# EasyEDA Pro project 无线充电发射板.eprj, schematic Schematic1
Create Date: 2023-07-04; Page Name: P1; Project Name: 高仿逐飞发射 (MOS管改）2; Schematic Name: Schematic1; Update Date: 2023-07-04; Company: 嘉立创EDA; Page Size: A4; Version: V1.0
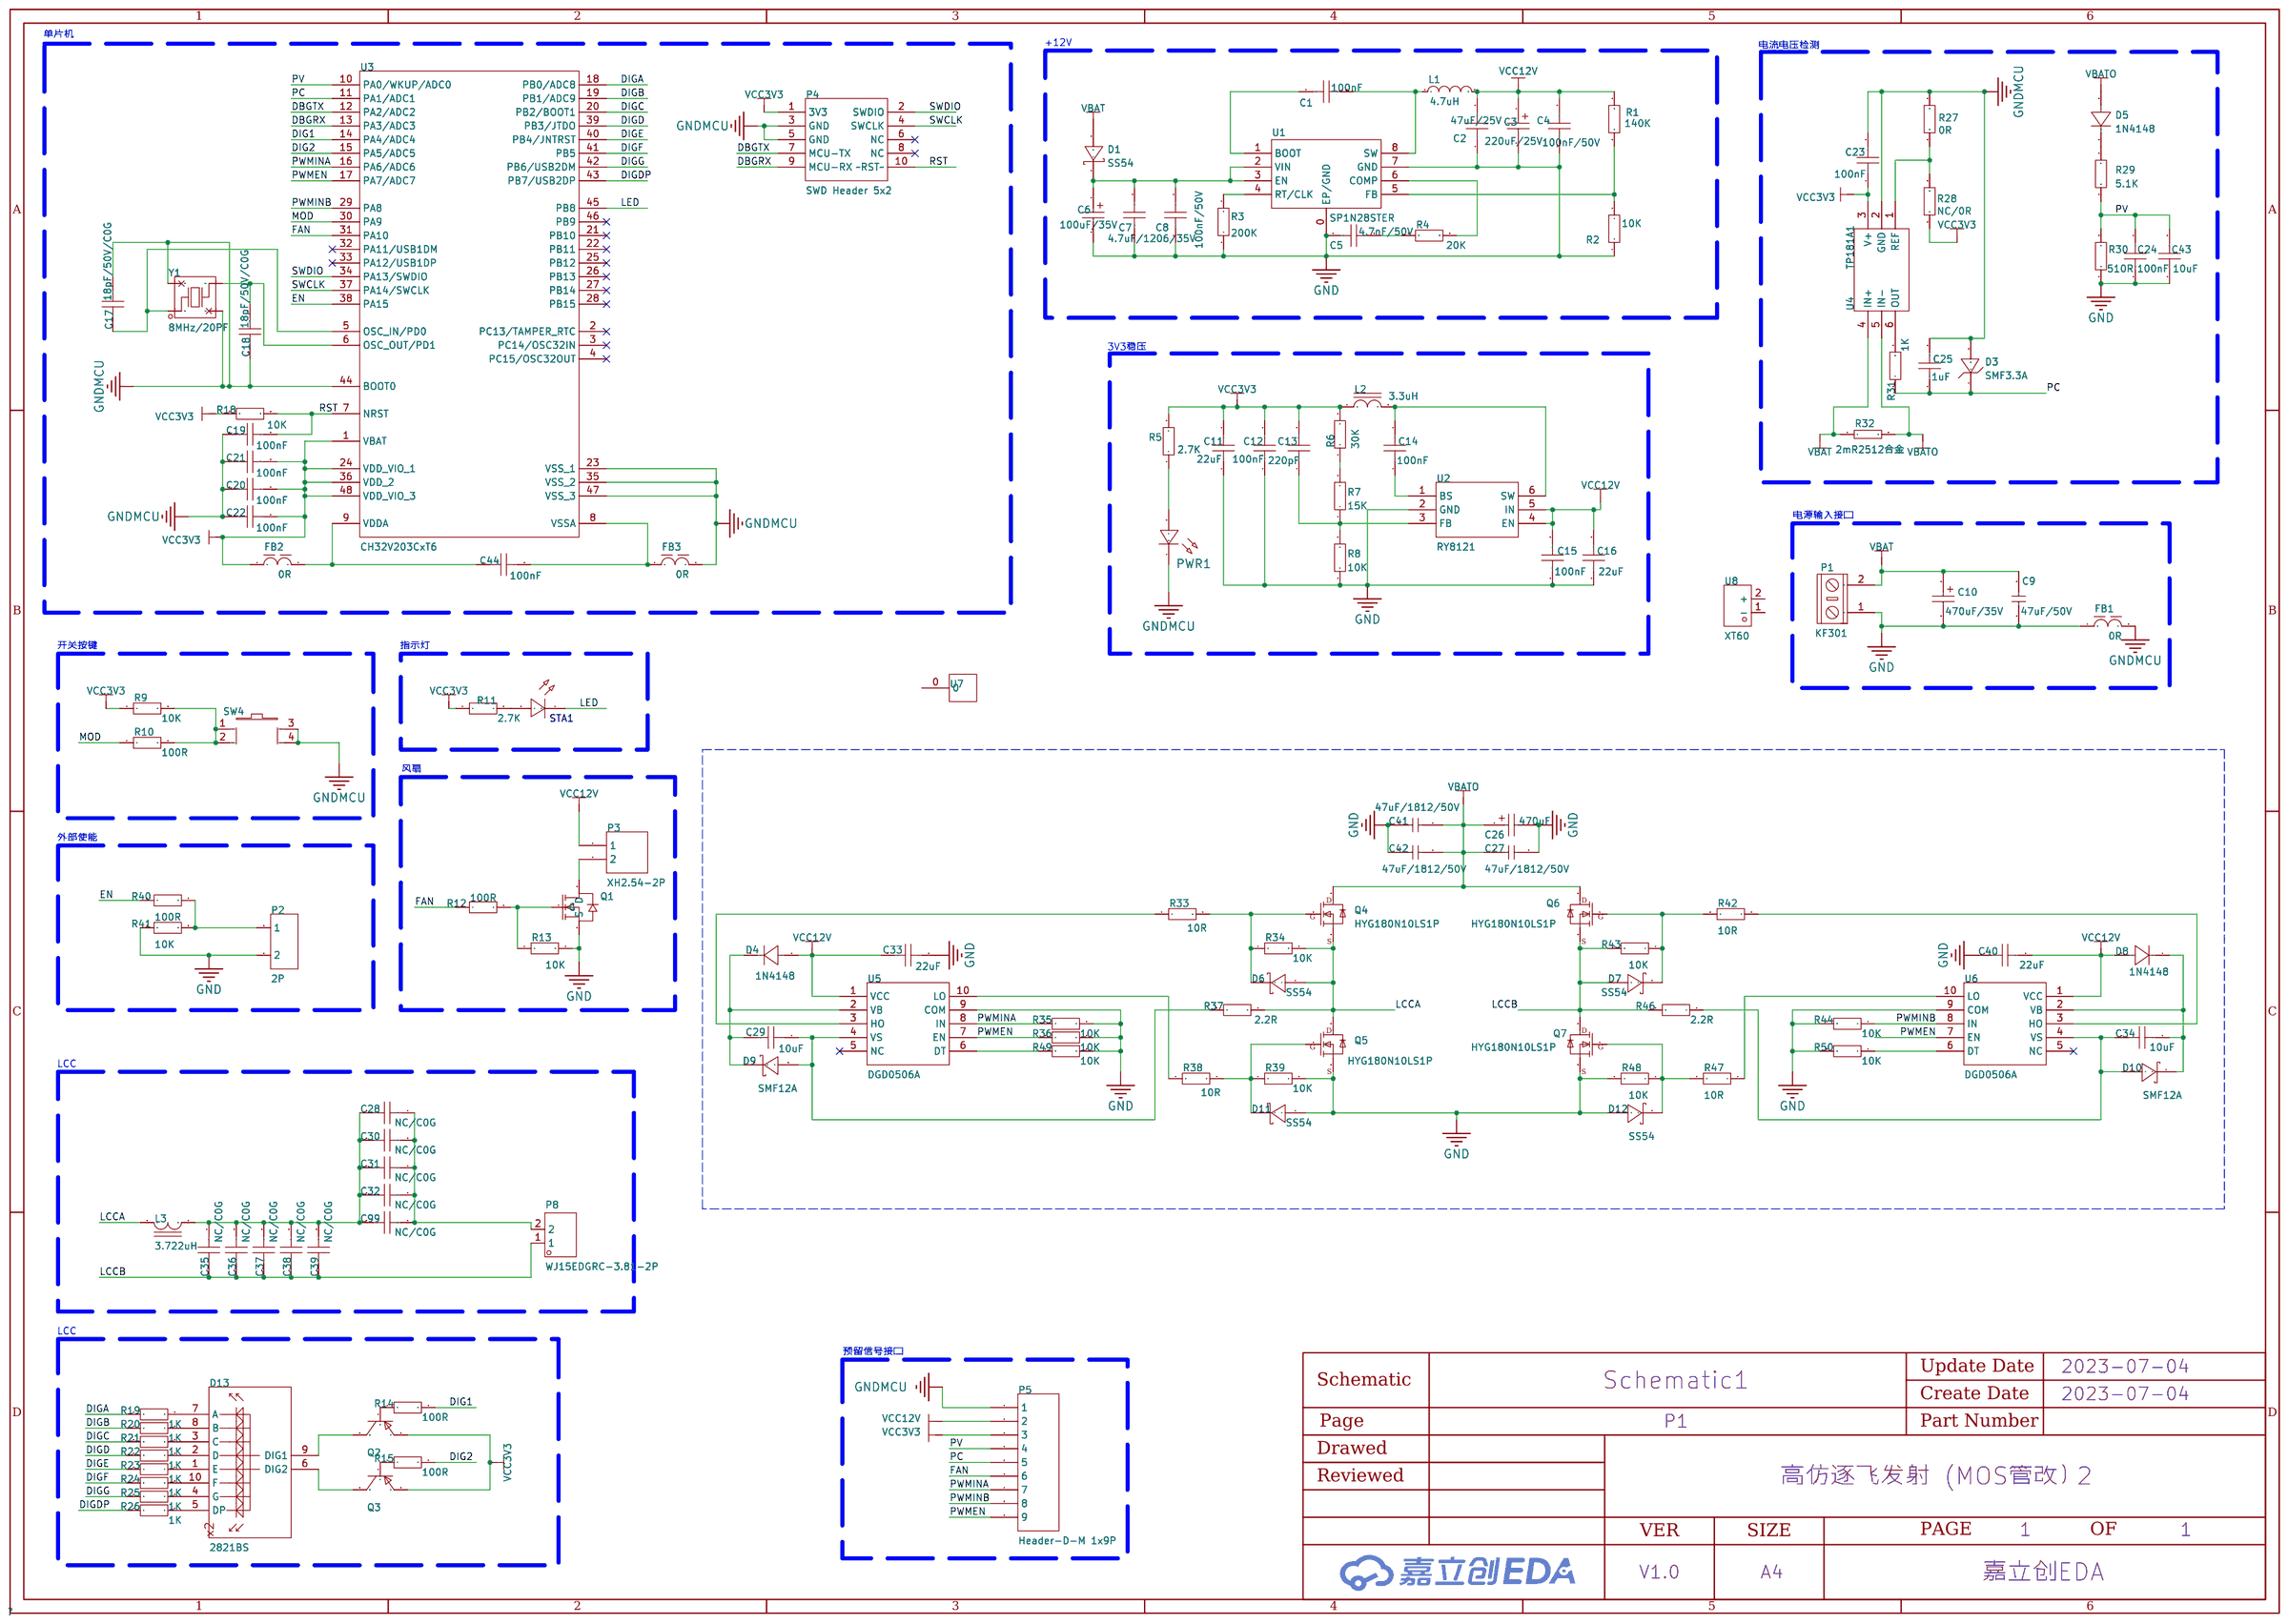
[diagram p0: schematic sheet]

## Parts
C1  100nF  [R0603]
C2  47uF/25V  [C1206]
C3  220uF  [Cap-S-D 2.5-6.3X8]
C4  100nF/50V  [R0603]
C5  4.7nF/50V  [R0603]
C6  100uF  [Cap-S-D 2.5-6.3X8]
C7  4.7uF/1206/35V  [C1206]
C8  100nF/50V  [R0603]
C9  47uF  [CAPC4532[1812]S]
C10  470uF  [Cap-S-D 3.5-8x14]
C11  22uF  [C0805]
C12  100nF  [R0603]
C13  220pF  [R0603]
C14  100nF  [R0603]
C15  100nF  [R0603]
C16  22uF  [C0805]
C17  18pF/50V/C0G  [R0603]
C18  18pF/50V/C0G  [R0603]
C19  100nF  [R0603]
C20  100nF  [R0603]
C21  100nF  [R0603]
C22  100nF  [R0603]
C23  100nF  [R0603]
C24  100nF  [R0603]
C25  1uF  [R0603]
C26  470uF  [Cap-S-D 3.5-8x14]
C27  47uF  [CAPC4532[1812]S]
C28  NC/C0G  [C1206]
C29  10uF  [C0805]
C30  NC/C0G  [C1206]
C31  NC/C0G  [C1206]
C32  NC/C0G  [C1206]
C33  22uF  [C0805]
C34  10uF  [C0805]
C35  NC/C0G  [C1206]
C36  NC/C0G  [C1206]
C37  NC/C0G  [C1206]
C38  NC/C0G  [C1206]
C39  NC/C0G  [C1206]
C40  22uF  [C0805]
C41  47uF  [CAPC4532[1812]S]
C42  47uF  [CAPC4532[1812]S]
C43  10uF  [C0805]
C44  100nF  [R0603]
C99  NC/C0G  [C1206]
D1  SS54  [SMA_L4.4-W2.8-LS5.4-R-RD]
D3  SMF3.3A  [SOD-123_L2.8-W1.8-LS3.7-RD]
D4  1N4148  [SOD-123_L2.7-W1.6-LS3.7-RD]
D5  1N4148  [SOD-123_L2.7-W1.6-LS3.7-RD]
D6  SS54  [SMA_L4.4-W2.8-LS5.4-R-RD]
D7  SS54  [SMA_L4.4-W2.8-LS5.4-R-RD]
D8  1N4148  [SOD-123_L2.7-W1.6-LS3.7-RD]
D9  SMF12A  [SOD-123F_L2.8-W1.8-LS3.7-RD]
D10  SMF12A  [SOD-123F_L2.8-W1.8-LS3.7-RD]
D11  SS54  [SMA_L4.4-W2.8-LS5.4-R-RD]
D12  SS54  [SMA_L4.4-W2.8-LS5.4-R-RD]
D13  2821BS  [2821AS/BS]
FB1  0R  [INDC1608[0603]S]
FB2  0R  [INDC1608[0603]S]
FB3  0R  [INDC1608[0603]S]
L1  4.7uH  [IND-SMD_L7.3-W6.6]
L2  3.3uH  [0402 TPC 4*4*2]
L3  3.722uH  [T94/106-LAY]
P1  KF301  [KF/WJ/DG 301-2p-5.0mm]
P2  2P  [HDR-TH_2P-P2.54-V-M-1]
P3  XH2.54-2P  [XH2.54-2P-DV]
P4  SWD  [HDR2X5-M]
P5  Header-D-M1x9P  [HDR1X9-M]
P8  WJ15EDGRC-3.81-2P  [CONN-TH_2P-P3.81_WJ15EDGRC-3.81-2P]
PWR1  -  [LED_0603]
Q1  -  [SOT-23-3_L2.9-W1.3-P1.90-LS2.4-BR]
Q2  -  [S8550P_SOT]
Q3  -  [S8550P_SOT]
Q4  HYG180N10LS1P  [TO-220-LAY]
Q5  HYG180N10LS1P  [TO-220-LAY]
Q6  HYG180N10LS1P  [TO-220-LAY]
Q7  HYG180N10LS1P  [TO-220-LAY]
R1  140K  [R0603]
R2  10K  [R0603]
R3  200K  [R0603]
R4  20K  [R0603]
R5  2.7K  [R0603]
R6  30K  [R0603]
R7  15K  [R0603]
R8  10K  [R0603]
R9  10K  [R0603]
R10  100R  [R0603]
R11  2.7K  [R0603]
R12  100R  [R0603]
R13  10K  [R0603]
R14  100R  [R0603]
R15  100R  [R0603]
R18  10K  [R0603]
R19  1K  [R0603]
R20  1K  [R0603]
R21  1K  [R0603]
R22  1K  [R0603]
R23  1K  [R0603]
R24  1K  [R0603]
R25  1K  [R0603]
R26  1K  [R0603]
R27  0R  [R0603]
R28  NC/0R  [R0603]
R29  5.1K  [R0603]
R30  510R  [R0603]
R31  1K  [R0603]
R32  2mR  [RESC6332[2512]S]
R33  10R  [R0805_NEW]
R34  10K  [R0805_NEW]
R35  10K  [R0603]
R36  10K  [R0603]
R37  2.2R  [R0805_NEW]
R38  10R  [R0805_NEW]
R39  10K  [R0805_NEW]
R40  100R  [R0603]
R41  10K  [R0603]
R42  10R  [R0805_NEW]
R43  10K  [R0805_NEW]
R44  10K  [R0603]
R46  2.2R  [R0805_NEW]
R47  10R  [R0805_NEW]
R48  10K  [R0805_NEW]
R49  10K  [R0603]
R50  10K  [R0603]
STA1  -  [LED_0603]
SW4  PTS810SJG250SMTRLFS  [SW-SMD_4P_PTS810SJM250SMTRLFS]
U1  SP1N28STER  [SP1N28STER]
U2  RY8121  [SOT-23-6]
U3  CH32V203CxT6  [LQFP48_L]
U4  TP181A1  [SOT-363]
U5  DGD0506A  [MSOP-10]
U6  DGD0506A  [MSOP-10]
U7  -  [Cooler-5.5]
U8  XT60  [CONN-TH_XT60]
Y1  8MHz/20PF  [X3225-4]

## Library data of the parts
C1 C4 C5 C8 C12-C15 C17-C25 C44 = CAP_0603: Supplier Footprint: 0603
C2 C7 C28 C30-C32 C35-C39 C99 = CAP_1206: Supplier Footprint: 1206
C3 = S-D 220uF 25V 6.3x8: Revision: V1.0; Type: 聚合物固态; Voltage: 25V
C6 = S-D 100uF 35V 6.3x8: Revision: V1.0; Type: 聚合物固态; Voltage: 35V
C9 C27 C41 C42 = 47uF 1812 50V X5R: Revision: V1.0; Voltage: 50V; Type: X5R; Origin Footprint 2: CAPC4532[1812]
C10 C26 = S-D 470uF 35V 8x14: Revision: V1.0; Type: 聚合物固态; Voltage: 35V
C11 C16 C29 C33 C34 C40 C43 = CAP_0805: Supplier Footprint: 0805
D1 D6 D7 D11 D12 = SS54_C22452: 直流反向耐压(Vr):40V;平均整流电流(Io):5A;正向压降(Vf):550mV@5A;; LCSC Part Name: 40V5A550mV@5A; Supplier Part: C22452; Manufacturer: MDD; Supplier Footprint: SMA(DO-214AC); JLCPCB Part Class: 基础库; Datasheet: https://atta.szlcsc.com/upload/public/pdf/source/20190306/C22452_DC5E4F74C3B638F6D8E4C7650D5BF30E.pdf; Supplier: LCSC; Reverse Voltage (Vr): 40V; Average Rectified Current (Io): 5A; Forward Voltage (Vf@If): 550mV@5A
D3 = SMF3.3A_C283866: 极性:单向;反向截止电压(Vrwm):3.3V;击穿电压:5.2V;反向漏电流(Ir):600uA;峰值脉冲电流(Ipp)@10/1000μs:25A;最大钳位电压:8V;; LCSC Part Name: 单向Vrwm:3.3V; Supplier Part: C283866; Manufacturer: DOWO(东沃); Supplier Footprint: SOD-123; JLCPCB Part Class: ExtendedPart; Datasheet: https://atta.szlcsc.com/upload/public/pdf/source/20180913/C283866_6B3FC7DB82D40F63EC323F6A8CE1774A.pdf; Supplier: LCSC; Polarity: 单向; Reverse Stand-Off Voltage (Vrwm): 3.3V; Breakdown Voltage: 5.2V; Reverse Leakage Current (Ir): 600uA; Peak Pulse Current (Ipp)@10/1000μs: 25A; Maximum Clamping Voltage: 8V
D4 D5 D8 = 1N4148W_C908248: 二极管配置:独立式;功率:400mW;直流反向耐压(Vr):75V;平均整流电流(Io):150mA;正向压降(Vf):1.25V@150mA;反向电流(Ir):2.5μA@75V;反向恢复时间(trr):8ns;工作温度:-55℃~+150℃@(Tj);; LCSC Part Name: 75V150mA8ns; Supplier Part: C908248; Manufacturer: FUXINSEMI(富芯森美); Supplier Footprint: SOD-123; JLCPCB Part Class: ExtendedPart; Datasheet: https://atta.szlcsc.com/upload/public/pdf/source/20201027/C908248_1CA42330540990D53F511325C125C4BD.pdf; Supplier: LCSC; Diode Configuration: 独立式; Power Dissipation: 400mW; Reverse Voltage (Vr): 75V; Average Rectified Current (Io): 150mA; Forward Voltage (Vf@If): 1.25V@150mA; Reverse Leakage Current: 2.5μA@75V; Reverse Recovery Time (trr): 8ns; Operating Temperature: -55℃~+150℃@(Tj)
D9 D10 = SMF12A_C207255: 极性:单向;反向截止电压(Vrwm):12V;击穿电压:13.3V;峰值脉冲电流(Ipp)@10/1000μs:-;最大钳位电压:19.9V;峰值脉冲功率(Ppp)@10/1000μs:200W;; LCSC Part Name: 单向Vrwm:12V200W; Supplier Part: C207255; Manufacturer: Littelfuse(美国力特); Supplier Footprint: SOD-123F; JLCPCB Part Class: ExtendedPart; Datasheet: https://atta.szlcsc.com/upload/public/pdf/source/20180517/C207255_4FB9557FD9A9DAB230014B48638D9A3D.pdf; Supplier: LCSC; Polarity: 单向; Reverse Stand-Off Voltage (Vrwm): 12V; Breakdown Voltage: 13.3V; Maximum Clamping Voltage: 19.9V; Peak Pulse Power Dissipation (Ppp)@10/1000μs: 200W
D13 = 2821BS
FB1-FB3 = FB-Chip: Published: 2020-12-18; Revision: V1.0; DCR: .1m; Frequency: @100MHz; Imax: 500mA; Origin Footprint 2: INDC2012[0805]S; Origin Footprint 3: INDC3216[1206]S; Origin Footprint 4: INDC4509[1806]S; Origin Footprint 5: INDC1005[0402]; Origin Footprint 6: INDC1608[0603]; Origin Footprint 7: INDC2012[0805]; Origin Footprint 8: INDC3216[1206]; Origin Footprint 9: INDC3225[1210]; Origin Footprint 10: INDC3216[1206]; Origin Footprint 11: INDC1005[0402]S
L1 = MCS0630-4R7MPY1: 电感值:4.7uH;精度:±20%;额定电流:5.5A;饱和电流(Isat):7A;直流电阻(DCR):37mΩ;; LCSC Part Name: 4.7uH±20%5.5A37mΩ; Supplier Part: C2937097; Manufacturer: PSA(信昌电陶); Supplier Footprint: 0630; JLCPCB Part Class: 扩展库; Datasheet: https://atta.szlcsc.com/upload/public/pdf/source/20220121/EA6E6E6F70ED7BAE67EC293805EAAACB.pdf; Supplier: LCSC; Tolerance: ±20%; Rated Current: 5.5A; Saturation Current (Isat): 7A; DC Resistance (DCR): 37mΩ
L2 = Ind-Power_1: Published: 8-Jun-2000; Revision: July-2002:Re-releasedforDXPPlatform.; Publisher: AltiumLimited; DCR: .5m; Price(RMB): 0.000; Imax: 2.5A; Origin Footprint 2: CD31; Origin Footprint 3: CD32; Origin Footprint 4: CD42; Origin Footprint 5: CD43; Origin Footprint 6: CD52; Origin Footprint 7: CD53; Origin Footprint 8: CD54; Origin Footprint 9: CD73; Origin Footprint 10: CD75; Origin Footprint 11: CD104; Origin Footprint 12: CD105; Origin Footprint 13: CD106; Origin Footprint 14: 127Shielded12.5*12.5*7; Origin Footprint 15: 0630TPC7*7*3; Origin Footprint 16: 1050TPC10*10*5; Origin Footprint 17: 1265TPC12*12*6.5; Origin Footprint 18: CD104R; Origin Footprint 19: SLO2520; Origin Footprint 20: 1365TPC13*13*6.5; Origin Footprint 21: INDUCTOR; Origin Footprint 22: INDUCTOR-H
L3 = Ind-Power_2: Published: 8-Jun-2000; Revision: July-2002:Re-releasedforDXPPlatform.; Publisher: AltiumLimited; Imax: 50mA; DCR: .5m; Price(RMB): 0.000; Origin Footprint 2: CD31; Origin Footprint 3: CD32; Origin Footprint 4: CD42; Origin Footprint 5: CD43; Origin Footprint 6: CD52; Origin Footprint 7: CD53; Origin Footprint 8: CD54; Origin Footprint 9: CD73; Origin Footprint 10: CD75; Origin Footprint 11: CD104; Origin Footprint 12: CD105; Origin Footprint 13: CD106; Origin Footprint 14: 127Shielded12.5*12.5*7; Origin Footprint 15: 0630TPC7*7*3; Origin Footprint 16: 1050TPC10*10*5; Origin Footprint 17: 1265TPC12*12*6.5; Origin Footprint 18: CD104R; Origin Footprint 19: SLO2520; Origin Footprint 20: 1365TPC13*13*6.5; Origin Footprint 21: T80125
P1 = KF/WJ/DG 30x
P2 = 826629-2: 排数:单排;总PIN位数:2;间距:2.54mm;插针结构:1x2P;行距:-;安装类型:直插;圆针/方针:-;额定电流:-;额定电压:-;配合针长度:-;塑高:2.8mm;触头材质:黄铜;触头镀层:-;颜色:绿色;; LCSC Part Name: 2.54mm1x2P直插; Supplier Part: C86471; Manufacturer: TEConnectivity(美国泰科); Supplier Footprint: 插件,P=2.54mm; JLCPCB Part Class: ExtendedPart; Datasheet: https://atta.szlcsc.com/upload/public/pdf/source/20161105/1478330325829.pdf; Supplier: LCSC; Number of Rows: 单排; Number of Pins: 2; Pitch: 2.54mm; Pin Structure: 1x2P; Mounting Type: 直插; Insulation Height: 2.8mm; Contact Material: 黄铜; Color: 绿色
P3 = XH2.54-2P: Revision: V1.0; Origin Footprint 2: XH2.54-2P-DH; Origin Footprint 3: XH2.54-2P-SH
P4 = SWD Header 5x2: Revision: V1.0; Origin Footprint 2: HDR2X5-M-SMT
P5 = Header-D-M 1x9P: Revision: V1.0
P8 = WJ15EDGRC-3.81-2P: 连接器类型:板端/插座-闭口;间距:3.81mm;排数:1;每排PIN数:2;安装方式:弯针;颜色:绿色;; LCSC Part Name: 板端/插座-闭口3.81mm排数:1每排P数:2弯针; Supplier Part: C8387; Manufacturer: KANGNEX(康奈克斯电气); Supplier Footprint: 弯插,P=3.81mm; JLCPCB Part Class: ExtendedPart; Datasheet: https://atta.szlcsc.com/upload/public/pdf/source/20191225/C8387_8EBAF10345D2762F0167C8753398EEFA.pdf; Supplier: LCSC; Connector Type: 板端/插座-闭口; Pitch: 3.81mm; Number of Rows: 1; Number of PINs Per Row: 2; Mounting Style: 弯针; Color: 绿色
PWR1 = LED_0603-R: Supplier Footprint: 0603
Q1 = AO3400A_N: 类型:N沟道;漏源电压(Vdss):30V;连续漏极电流(Id):5.2A;功率(Pd):1W;导通电阻(RDS(on)@Vgs,Id):35mΩ@10V,5A;阈值电压(Vgs(th)@Id):1.5V@250μA;; Supplier Footprint: SOT-23; Supplier Part: C700953
Q2 Q3 = S8550_SOT_PNP: Supplier Footprint: SOT-23
Q4-Q7 = HYG180N10LS1P: Origin Footprint 2: TO-220
R1-R15 R18-R31 R33-R44 R46-R50 = Res_0603: Supplier Footprint: 0603
R32 = Res-Chip_10: Revision: V1.0; Power: 1/8W; Tolerance: ±1%; Origin Footprint 2: RESC0603[0201]-L; Origin Footprint 3: RESC0603[0201]-M; Origin Footprint 4: RESC0603[0201]-N; Origin Footprint 5: RESC0603[0201]S-L; Origin Footprint 6: RESC0603[0201]S-M; Origin Footprint 7: RESC0603[0201]S-N; Origin Footprint 8: RESC1005[0402]-L; Origin Footprint 9: RESC1005[0402]S-M; Origin Footprint 10: RESC1005[0402]-M; Origin Footprint 11: RESC1005[0402]-N; Origin Footprint 12: RESC1005[0402]S-L; Origin Footprint 13: RESC1005[0402]S-N; Origin Footprint 14: RESC1608[0603]-L; Origin Footprint 15: RESC1608[0603]-M; Origin Footprint 16: RESC1608[0603]-N; Origin Footprint 17: RESC1608[0603]S-L; Origin Footprint 18: RESC1608[0603]S-M; Origin Footprint 19: RESC1608[0603]S-N; Origin Footprint 20: RESC2012[0805]; Origin Footprint 21: RESC2012[0805]S-L; Origin Footprint 22: RESC2012[0805]S-M; Origin Footprint 23: RESC2012[0805]S-N; Origin Footprint 24: RESC3216[1206]; Origin Footprint 25: RESC3216[1206]S-L; Origin Footprint 26: RESC3216[1206]S-M; Origin Footprint 27: RESC3216[1206]S-N; Origin Footprint 28: RESC3225[1210]; Origin Footprint 29: RESC3225[1210]S; Origin Footprint 30: RESC5025[2010]; Origin Footprint 31: RESC5025[2010]S; Origin Footprint 32: RESC6332[2512]
STA1 = LED_0603-B: Supplier Footprint: 0603
SW4 = PTS810SJG250SMTRLFS: 触点电流:50mA;额定电压(DC):16V;电路结构:单刀单掷;安装方式:-;按钮形状:圆形按钮;带灯:-;开关长度:4.2mm;开关宽度:3.2mm;开关高度:2.5mm;; LCSC Part Name: 轻触开关4.2mm*3.2mm，400gf; Supplier Part: C221895; Manufacturer: C&K; Supplier Footprint: SMD-4P,3.2x4.2mm; JLCPCB Part Class: 扩展库; Datasheet: https://atta.szlcsc.com/upload/public/pdf/source/20180613/C221895_55CF695EE8924704F52B2E6A8B378F91.pdf; Supplier: LCSC; Contact Current: 50mA; Voltage Rating (DC): 16V; Circuit: 单刀单掷; Actuator Style: 圆形按钮; Switch Length: 4.2mm; Switch Width: 3.2mm; Switch Height: 2.5mm
U1 = SP1N28STER: Revision: V1.0
U2 = RY8121
U3 = CH32V203CxT6: Published: 30-May-2008; DatasheetVersion: rev6,Mar-2008; PackageVersion: Mar-2008; PackageReference: LQFP48; Publisher: AltiumLimited; PackageDescription: 48-PinLow-ProfileQuadFlatPack,7x7mmBody,0.5mmPitch(LQFP48); ComponentLink1Description: ManufacturerLink; ComponentLink1URL: www.st.com/stm32; ComponentLink2Description: Datasheet; ComponentLink2URL: http://www.st.com/stonline/products/literature/ds/13587.pdf; Origin Footprint 2: LQFP48_N; Origin Footprint 3: LQFP48_M
U4 = TP181Ax
U5 U6 = DGD0506A
U7 = fan
U8 = XT60: 模型锂电连接器 XT60-M; LCSC Part Name: AMASS(艾迈斯) XT60模型插头 3.5mm镀金香蕉头公头（电调端）XT60-M; Supplier Part: C98733; Manufacturer: AMASS(艾迈斯); JLCPCB Part Class: Extended Part; Datasheet: https://atta.szlcsc.com/upload/public/pdf/source/20170606/1496716524919.pdf; Supplier: LCSC
Y1 = XTAL-4: Published: 8-Jun-2000; Revision: July-2002:Re-releasedforDXPPlatform.; Publisher: AltiumLimited; Load Capactiance: 20pF; Frequency: 8MHz; Origin Footprint 2: X2016-4

## Nets
GND: C2.1 C3.2 C4.1 C5.1 C6.2 C7.1 C8.1 C9.1 C10.2 C11.1 C12.1 C15.1 C16.1 C24.1 C26.2 C27.2 C33.1 C40.1 C41.1 C42.1 C43.1 D11.1(A) D12.1(A) FB1.1 P1.1 P2.2 Q1.2(S) Q5.3(S) Q7.3(S) R2.1 R3.1 R8.1 R13.2 R30.1 R35.2 R36.2 R39.2 R41.1 R44.2 R48.2 R49.2 R50.2 U1.0(EP/GND) U1.7(GND) U2.2(GND) U5.9(COM) U6.9(COM)
GNDMCU: C17.2 C18.1 C19.1 C20.1 C21.1 C22.1 C23.2 C25.2 D3.2 FB1.2 FB3.2 P4.3(GND) P4.5(GND) P5.1 PWR1.1(C) R27.2 SW4.3 SW4.4 U3.23(VSS_1) U3.35(VSS_2) U3.44(BOOT0) U3.47(VSS_3) U4.2(GND) Y1.2(NC) Y1.4(NC)
VBAT: C9.2 C10.1 D1.1(A) P1.2 R32.1 U4.4(IN+)
VBATO: C26.1 C27.1 C41.2 C42.2 D5.2(A) Q4.2(D) Q6.2(D) R32.2 U4.5(IN-)
VCC3V3: C11.2 C12.2 C13.2 C20.2 C21.2 C22.2 C23.1 FB2.1 L2.1 P4.1(3V3) P5.3 Q2.2(E) Q3.2(E) R5.2 R6.2 R9.1 R11.1 R18.1 R28.1 U3.1(VBAT) U3.24(VDD_VIO_1) U3.36(VDD_2) U3.48(VDD_VIO_3) U4.3(V+)
VCC12V: C2.2 C3.1 C4.2 C15.2 C16.2 C33.2 C40.2 D4.2(A) D8.2(A) L1.2 P3.1 P5.2 R1.2 U2.4(EN) U2.5(IN) U5.1(VCC) U6.1(VCC)
DBGRX: P4.9(MCU-RX) U3.13(PA3/ADC3)
DBGTX: P4.7(MCU-TX) U3.12(PA2/ADC2)
DIG1: R14.2 U3.14(PA4/ADC4)
DIG2: R15.2 U3.15(PA5/ADC5)
DIGA: R19.1 U3.18(PB0/ADC8)
DIGB: R20.1 U3.19(PB1/ADC9)
DIGC: R21.1 U3.20(PB2/BOOT1)
DIGD: R22.1 U3.39(PB3/JTDO)
DIGDP: R26.1 U3.43(PB7/USB2DP)
DIGE: R23.1 U3.40(PB4/JNTRST)
DIGF: R24.1 U3.41(PB5)
DIGG: R25.1 U3.42(PB6/USB2DM)
EN: R40.1 U3.38(PA15)
FAN: P5.6 R12.1 U3.31(PA10)
LCCA: D6.1(A) L3.2 Q4.3(S) Q5.2(D) R34.2 R37.2
LCCB: C35.1 C36.1 C37.1 C38.1 C39.1 D7.1(A) P8.1 Q6.3(S) Q7.2(D) R43.2 R46.2
LED: STA1.1(C) U3.45(PB8)
MOD: R10.1 U3.30(PA9)
PC: C25.1 D3.1 P5.5 R31.1 U3.11(PA1/ADC1)
PV: C24.2 C43.2 P5.4 R29.1 R30.2 U3.10(PA0/WKUP/ADC0)
PWMEN: P5.9 R36.1 U3.17(PA7/ADC7) U5.7(EN) U6.7(EN)
PWMINA: P5.7 R35.1 U3.16(PA6/ADC6) U5.8(IN)
PWMINB: P5.8 R44.1 U3.29(PA8) U6.8(IN)
RST: C19.2 P4.10(~RST~) R18.2 U3.7(NRST)
SWCLK: P4.4(SWCLK) U3.37(PA14/SWCLK)
SWDIO: P4.2(SWDIO) U3.34(PA13/SWDIO)
$C1_1: C1.1 U1.1(BOOT)
$C1_2: C1.2 L1.1 U1.8(SW)
$C5_2: C5.2 R4.1
$C6_1: C6.1 C7.2 C8.2 D1.2(K) U1.2(VIN) U1.3(EN)
$C13_1: C13.1 R7.1 R8.2 U2.3(FB)
$C14_1: C14.1 U2.1(BS)
$C14_2: C14.2 L2.2 U2.6(SW)
$C17_1: C17.1 U3.5(OSC_IN/PD0) Y1.1(OSC1)
$C18_2: C18.2 U3.6(OSC_OUT/PD1) Y1.3(OSC2)
$C28_1: C28.1 C30.1 C31.1 C32.1 C99.1 P8.2
$C28_2: C28.2 C30.2 C31.2 C32.2 C35.2 C36.2 C37.2 C38.2 C39.2 C99.2 L3.1
$C29_1: C29.1 D9.2(A) R37.1 U5.4(VS)
$C29_2: C29.2 D4.1(K) D9.1(K) U5.2(VB)
$C34_1: C34.1 D10.2(A) R46.1 U6.4(VS)
$C34_2: C34.2 D8.1(K) D10.1(K) U6.2(VB)
$C44_1: C44.1 FB2.2 U3.9(VDDA)
$C44_2: C44.2 FB3.1 U3.8(VSSA)
$D5_1: D5.1(K) R29.2
$D6_2: D6.2(K) Q4.1(G) R33.2 R34.1
$D7_2: D7.2(K) Q6.1(G) R42.2 R43.1
$D11_2: D11.2(K) Q5.1(G) R38.2 R39.1
$D12_2: D12.2(K) Q7.1(G) R47.2 R48.1
$D13_1: D13.1(E) R23.2
$D13_2: D13.2(D) R22.2
$D13_3: D13.3(C) R21.2
$D13_4: D13.4(G) R25.2
$D13_5: D13.5(DP) R26.2
$D13_6: D13.6(DIG2) Q3.3(C)
$D13_7: D13.7(A) R19.2
$D13_8: D13.8(B) R20.2
$D13_9: D13.9(DIG1) Q2.3(C)
$D13_10: D13.10(F) R24.2
$P2_1: P2.1 R40.2 R41.2
$P3_2: P3.2 Q1.3(D)
$PWR1_2: PWR1.2(A) R5.1
$Q1_1: Q1.1(G) R12.2 R13.1
$Q2_1: Q2.1(B) R14.1
$Q3_1: Q3.1(B) R15.1
$R1_1: R1.1 R2.2 U1.5(FB)
$R3_2: R3.2 U1.4(RT/CLK)
$R4_2: R4.2 U1.6(COMP)
$R6_1: R6.1 R7.2
$R9_2: R9.2 R10.2 SW4.1 SW4.2
$R11_2: R11.2 STA1.2(A)
$R27_1: R27.1 R28.2 U4.1(REF)
$R31_2: R31.2 U4.6(OUT)
$R33_1: R33.1 U5.3(HO)
$R38_1: R38.1 U5.10(LO)
$R42_1: R42.1 U6.3(HO)
$R47_1: R47.1 U6.10(LO)
$R49_1: R49.1 U5.6(DT)
$R50_1: R50.1 U6.6(DT)

Not connected (* = marked no-connect by the designer): P4 6(NC)* 8(NC)*; U3 2(PC13/TAMPER_RTC)* 3(PC14/OSC32IN)* 4(PC15/OSC32OUT)* 21(PB10)* 22(PB11)* 25(PB12)* 26(PB13)* 27(PB14)* 28(PB15)* 32(PA11/USB1DM)* 33(PA12/USB1DP)* 46(PB9)*; U5 5(NC)*; U6 5(NC)*; U7 0; U8 1(-) 2(+)

## Notes on the sheet
- 单片机
- +12V
- 电流电压检测
- 3V3稳压
- 电源输入接口
- 开关按键
- 指示灯
- 风扇
- 外部使能
- LCC
- LCC
- 预留信号接口
